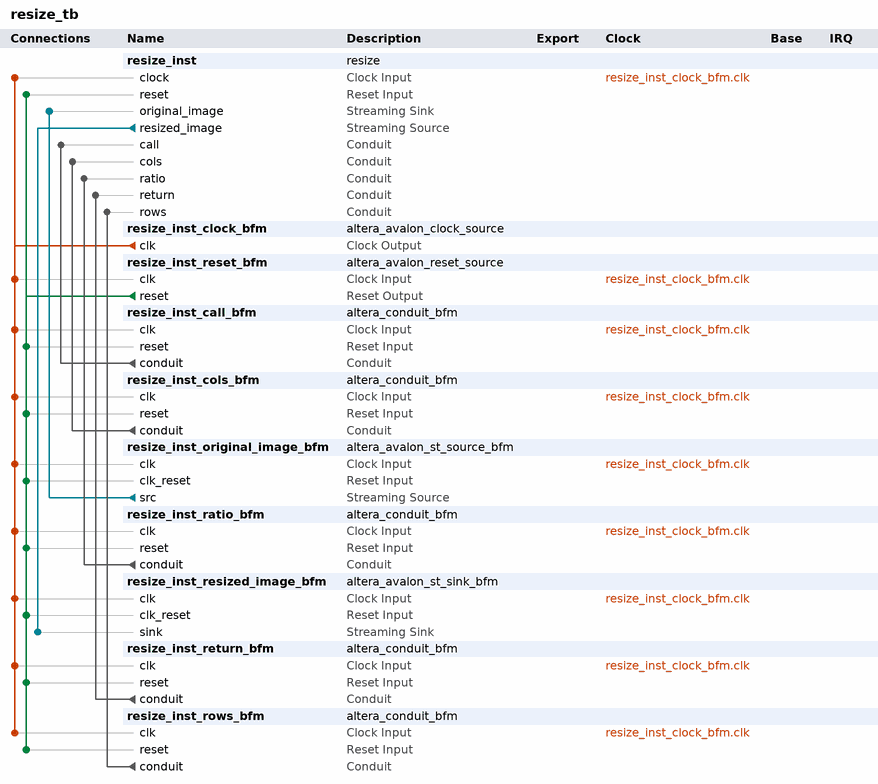
[diagram p0: system contents]
# Platform Designer (Qsys) system resize_tb, Cyclone V 5CSEMA4U23C6
# Parameters at their usual value, and those the tool derives, are not listed.
package require -exact qsys 17.1
create_system resize_tb
set_project_property DEVICE_FAMILY {Cyclone V}
set_project_property DEVICE 5CSEMA4U23C6

add_instance resize_inst resize 1.0

add_instance resize_inst_clock_bfm altera_avalon_clock_source 17.1

add_instance resize_inst_reset_bfm altera_avalon_reset_source 17.1
set_instance_parameter_value resize_inst_reset_bfm ASSERT_HIGH_RESET 0
set_instance_parameter_value resize_inst_reset_bfm INITIAL_RESET_CYCLES 50

add_instance resize_inst_call_bfm altera_conduit_bfm 17.1
set_instance_parameter_value resize_inst_call_bfm CLOCKED_SIGNAL true
set_instance_parameter_value resize_inst_call_bfm ENABLE_RESET true
set_instance_parameter_value resize_inst_call_bfm SIGNAL_DIRECTIONS input,output
set_instance_parameter_value resize_inst_call_bfm SIGNAL_ROLES stall,valid
set_instance_parameter_value resize_inst_call_bfm SIGNAL_WIDTHS 1,1

add_instance resize_inst_cols_bfm altera_conduit_bfm 17.1
set_instance_parameter_value resize_inst_cols_bfm CLOCKED_SIGNAL true
set_instance_parameter_value resize_inst_cols_bfm ENABLE_RESET true
set_instance_parameter_value resize_inst_cols_bfm SIGNAL_DIRECTIONS output
set_instance_parameter_value resize_inst_cols_bfm SIGNAL_ROLES data
set_instance_parameter_value resize_inst_cols_bfm SIGNAL_WIDTHS 32

add_instance resize_inst_original_image_bfm altera_avalon_st_source_bfm 17.1
set_instance_parameter_value resize_inst_original_image_bfm ST_CHANNEL_W 1
set_instance_parameter_value resize_inst_original_image_bfm ST_ERROR_W 1
set_instance_parameter_value resize_inst_original_image_bfm ST_MAX_CHANNELS 0
set_instance_parameter_value resize_inst_original_image_bfm ST_NUMSYMBOLS 1
set_instance_parameter_value resize_inst_original_image_bfm ST_SYMBOL_W 32
set_instance_parameter_value resize_inst_original_image_bfm USE_CHANNEL 0
set_instance_parameter_value resize_inst_original_image_bfm USE_EMPTY 0
set_instance_parameter_value resize_inst_original_image_bfm USE_ERROR 0
set_instance_parameter_value resize_inst_original_image_bfm USE_PACKET 0
set_instance_parameter_value resize_inst_original_image_bfm USE_READY 1
set_instance_parameter_value resize_inst_original_image_bfm USE_VALID 1

add_instance resize_inst_ratio_bfm altera_conduit_bfm 17.1
set_instance_parameter_value resize_inst_ratio_bfm CLOCKED_SIGNAL true
set_instance_parameter_value resize_inst_ratio_bfm ENABLE_RESET true
set_instance_parameter_value resize_inst_ratio_bfm SIGNAL_DIRECTIONS output
set_instance_parameter_value resize_inst_ratio_bfm SIGNAL_ROLES data
set_instance_parameter_value resize_inst_ratio_bfm SIGNAL_WIDTHS 32

add_instance resize_inst_resized_image_bfm altera_avalon_st_sink_bfm 17.1
set_instance_parameter_value resize_inst_resized_image_bfm ST_CHANNEL_W 1
set_instance_parameter_value resize_inst_resized_image_bfm ST_ERROR_W 1
set_instance_parameter_value resize_inst_resized_image_bfm ST_MAX_CHANNELS 0
set_instance_parameter_value resize_inst_resized_image_bfm ST_NUMSYMBOLS 1
set_instance_parameter_value resize_inst_resized_image_bfm ST_READY_LATENCY 0
set_instance_parameter_value resize_inst_resized_image_bfm ST_SYMBOL_W 32
set_instance_parameter_value resize_inst_resized_image_bfm USE_CHANNEL 0
set_instance_parameter_value resize_inst_resized_image_bfm USE_EMPTY 0
set_instance_parameter_value resize_inst_resized_image_bfm USE_ERROR 0
set_instance_parameter_value resize_inst_resized_image_bfm USE_PACKET 0
set_instance_parameter_value resize_inst_resized_image_bfm USE_READY 1
set_instance_parameter_value resize_inst_resized_image_bfm USE_VALID 1
set_instance_parameter_value resize_inst_resized_image_bfm VHDL_ID 0

add_instance resize_inst_return_bfm altera_conduit_bfm 17.1
set_instance_parameter_value resize_inst_return_bfm CLOCKED_SIGNAL true
set_instance_parameter_value resize_inst_return_bfm ENABLE_RESET true
set_instance_parameter_value resize_inst_return_bfm SIGNAL_DIRECTIONS input,output
set_instance_parameter_value resize_inst_return_bfm SIGNAL_ROLES valid,stall
set_instance_parameter_value resize_inst_return_bfm SIGNAL_WIDTHS 1,1

add_instance resize_inst_rows_bfm altera_conduit_bfm 17.1
set_instance_parameter_value resize_inst_rows_bfm CLOCKED_SIGNAL true
set_instance_parameter_value resize_inst_rows_bfm ENABLE_RESET true
set_instance_parameter_value resize_inst_rows_bfm SIGNAL_DIRECTIONS output
set_instance_parameter_value resize_inst_rows_bfm SIGNAL_ROLES data
set_instance_parameter_value resize_inst_rows_bfm SIGNAL_WIDTHS 32

# connections
add_connection resize_inst_clock_bfm.clk resize_inst.clock clock
add_connection resize_inst_clock_bfm.clk resize_inst_call_bfm.clk clock
add_connection resize_inst_clock_bfm.clk resize_inst_cols_bfm.clk clock
add_connection resize_inst_clock_bfm.clk resize_inst_original_image_bfm.clk clock
add_connection resize_inst_clock_bfm.clk resize_inst_ratio_bfm.clk clock
add_connection resize_inst_clock_bfm.clk resize_inst_reset_bfm.clk clock
add_connection resize_inst_clock_bfm.clk resize_inst_resized_image_bfm.clk clock
add_connection resize_inst_clock_bfm.clk resize_inst_return_bfm.clk clock
add_connection resize_inst_clock_bfm.clk resize_inst_rows_bfm.clk clock
add_connection resize_inst_reset_bfm.reset resize_inst.reset reset
add_connection resize_inst_reset_bfm.reset resize_inst_call_bfm.reset reset
add_connection resize_inst_reset_bfm.reset resize_inst_cols_bfm.reset reset
add_connection resize_inst_reset_bfm.reset resize_inst_original_image_bfm.clk_reset reset
add_connection resize_inst_reset_bfm.reset resize_inst_ratio_bfm.reset reset
add_connection resize_inst_reset_bfm.reset resize_inst_resized_image_bfm.clk_reset reset
add_connection resize_inst_reset_bfm.reset resize_inst_return_bfm.reset reset
add_connection resize_inst_reset_bfm.reset resize_inst_rows_bfm.reset reset
add_connection resize_inst.resized_image resize_inst_resized_image_bfm.sink avalon_streaming
add_connection resize_inst_original_image_bfm.src resize_inst.original_image avalon_streaming
add_connection resize_inst_call_bfm.conduit resize_inst.call conduit
add_connection resize_inst_cols_bfm.conduit resize_inst.cols conduit
add_connection resize_inst_ratio_bfm.conduit resize_inst.ratio conduit
add_connection resize_inst_return_bfm.conduit resize_inst.return conduit
add_connection resize_inst_rows_bfm.conduit resize_inst.rows conduit

set_interconnect_requirement {$system} qsys_mm.clockCrossingAdapter HANDSHAKE
set_interconnect_requirement {$system} qsys_mm.enableEccProtection FALSE
set_interconnect_requirement {$system} qsys_mm.insertDefaultSlave FALSE
set_interconnect_requirement {$system} qsys_mm.maxAdditionalLatency 1

save_system resize_tb.qsys
